# Altium schematic sheet Power_Supply_And_Connections.SchDoc
size A
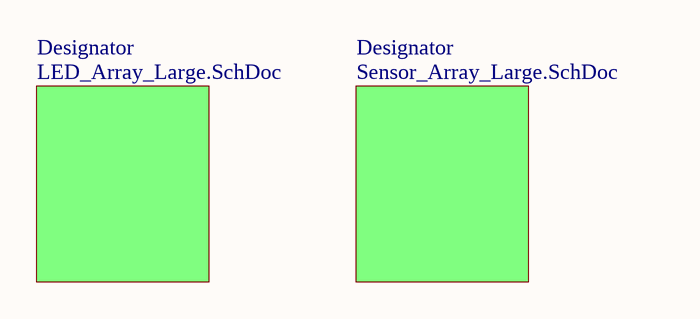
[diagram p0: Power_Supply_And_Connections.SchDoc]

## Sub-sheets
Designator = LED_Array_Large.SchDoc: no entries
Designator = Sensor_Array_Large.SchDoc: no entries